# Altium project Sub1G_V2.2_ZM_COM_DOWN_revA1_20160823.PrjPCB
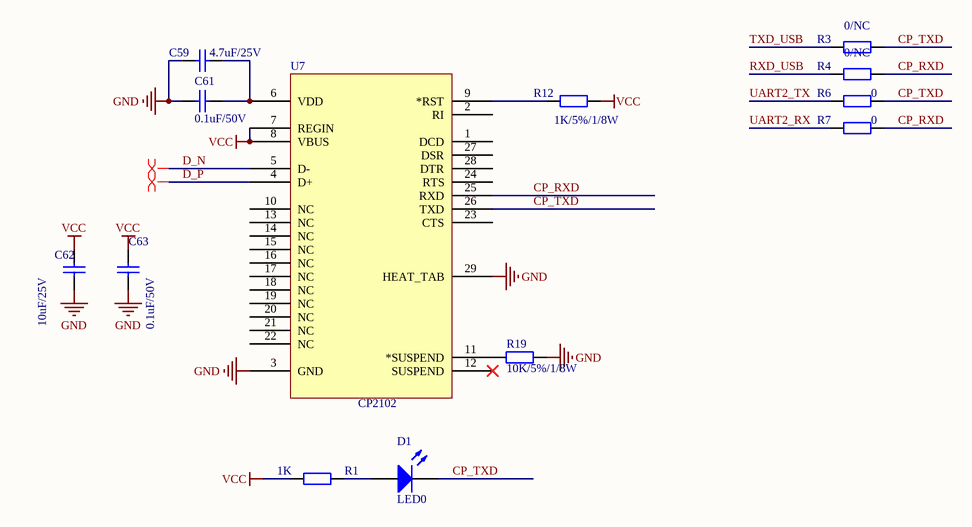
[diagram p0: USB.SchDoc]
3 sheets, 41 parts. Net scope: global (net labels, ports and power ports of the same name join across sheets).
Board files: 拼板.PcbDoc, PCB1.PcbDoc
Sheets:
  USB.SchDoc
  Interface.SchDoc
  RS232.SchDoc

## Sheet USB.SchDoc
size A4

### Parts
C59  4.7uF/25V  [0603C]
C61  0.1uF/50V  [0402C]
C62  10uF/25V  [0603C]
C63  0.1uF/50V  [0402C]
D1  LED0  [0603LED]
R1  1K  [0402R]
R3  0/NC  [0402R]
R4  0/NC  [0402R]
R6  0  [0402R]
R7  0  [0402R]
R12  1K/5%/1/8W  [0402R]
R19  10K/5%/1/8W  [0402R]
U7  CP2102  [QFN28N5X5-0p5P-L]

### Nets
GND: C59.1 C61.2 C62.2 C63.2 R19.1 U7.3(GND) U7.29(HEAT_TAB)
VCC: C62.1 C63.1 R1.1 R12.1 U7.7(REGIN) U7.8(VBUS)
CP_RXD: R4.1 R7.1 U7.25(RXD)
CP_TXD: D1.2(K) R3.1 R6.1 U7.26(TXD)
D_N: U7.5(D-)
D_P: U7.4(D+)
RXD_USB: R4.2
TXD_USB: R3.2
UART2_RX: R7.2
UART2_TX: R6.2
NetC59_2: C59.2 C61.1 U7.6(VDD)
NetD1_1: D1.1(A) R1.2
NetR12_2: R12.2 U7.9(*RST)
NetR19_2: R19.2 U7.11(*SUSPEND)

Not connected (* = marked no-connect by the designer): U7 1(DCD) 2(RI) 10(NC) 12(SUSPEND)* 13(NC) 14(NC) 15(NC) 16(NC) 17(NC) 18(NC) 19(NC) 20(NC) 21(NC) 22(NC) 23(CTS) 24(RTS) 27(DSR) 28(DTR)

### Layout directives
differential pair: D_N, D_P

### Library data of the parts
C59 = Cap: Capacitor; Value: 1uF; Published: 8-Jun-2000; LatestRevisionDate: 17-Jul-2002; LatestRevisionNote: Re-released for DXP Platform.; PackageReference: RAD-0.3; Publisher: Altium Limited
C61 C63 = Cap: Capacitor; Value: 104; Published: 8-Jun-2000; LatestRevisionDate: 17-Jul-2002; LatestRevisionNote: Re-released for DXP Platform.; PackageReference: RAD-0.3; Publisher: Altium Limited
C62 = Cap: Capacitor; Value: 106; Published: 8-Jun-2000; LatestRevisionDate: 17-Jul-2002; LatestRevisionNote: Re-released for DXP Platform.; PackageReference: RAD-0.3; Publisher: Altium Limited
D1 = LED0: Typical INFRARED GaAs LED; Published: 8-Jun-2000; LatestRevisionDate: 08-Jul-2005; LatestRevisionNote: Mech Layer 1 removed.; PackageReference: LED-0; Publisher: Altium Limited
R1 = Resistor: Resistor SMD - IEC symbol version; Value: NC; LatestRevisionDate: 27-Jul-20  -  Semtech
R3 R4 R6 R7 R12 = Res2: Resistor; Value: 1K; Published: 8-Jun-2000; LatestRevisionDate: 17-Jul-2002; LatestRevisionNote: Re-released for DXP Platform.; PackageReference: AXIAL-0.4; Publisher: Altium Limited
R19 = Res2: Resistor; Published: 8-Jun-2000; LatestRevisionDate: 17-Jul-2002; LatestRevisionNote: Re-released for DXP Platform.; PackageReference: AXIAL-0.4; Publisher: Altium Limited; Value: 10K/5%/1/8W
U7 = CP2102: Imported; PART DESC: SINGLE-CHIP USB TO UART BRIDGE, QFN28, RoHS.; MFG #1: SILICON LABS; PART NUMBER: CP2102; Value: Value; RefDes: RefDes; Type: DEV

## Sheet Interface.SchDoc
size A4
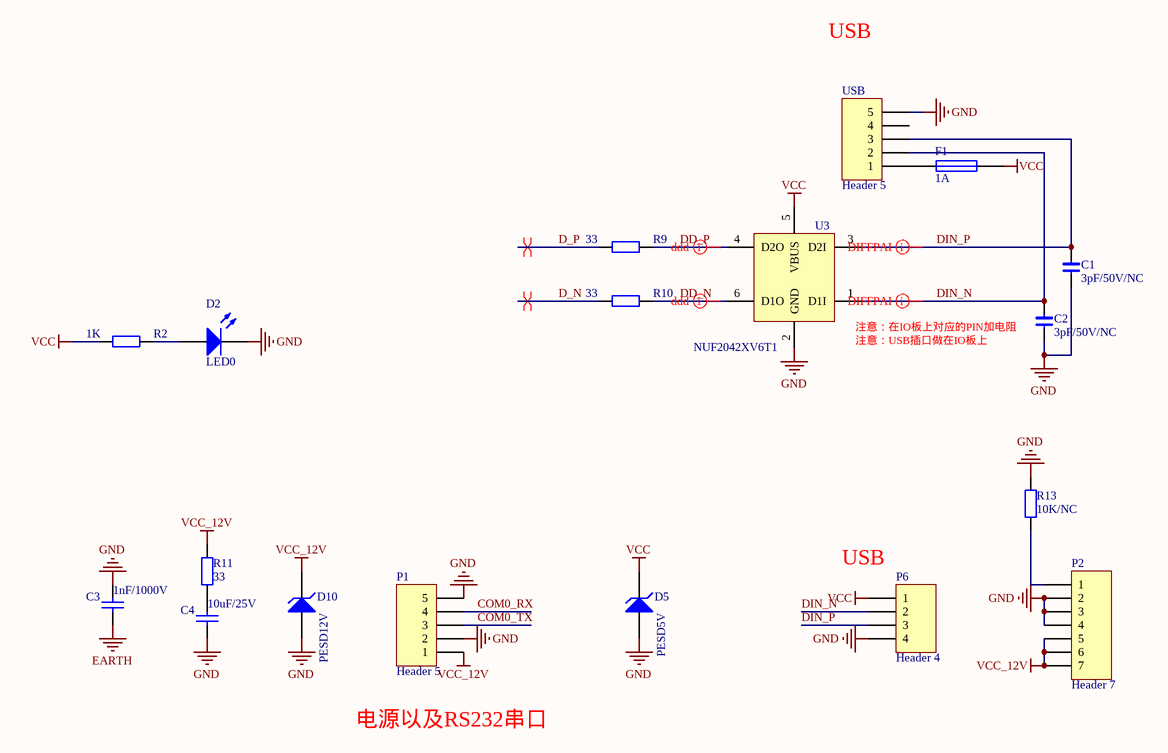
[diagram p1: Interface.SchDoc]

### Parts
C1  3pF/50V/NC  [0402C]
C2  3pF/50V/NC  [0402C]
C3  1nF/1000V  [1206C]
C4  10uF/25V  [0603C]
D2  LED0  [0603LED]
D5  PESD5V  [SOD323]
D10  PESD12V  [SOD323]
F1  1A  [0805R]
P1  Header 5  [KF350-5P]
P2  Header 7  [7×1.25mmSMT]
P6  Header 4  [4×1.25mmSMT]
R2  1K  [0402R]
R9  33  [0402R]
R10  33  [0402R]
R11  33  [0402R]
R13  10K/NC  [0402R]
U3  NUF2042XV6T1  [SOT563-6]
USB  Header 5  [Micro_USB_PH]

### Nets
EARTH: C3.1
GND: C1.2 C2.2 C3.2 C4.1 D2.2(K) D5.A D10.A P1.2 P1.5 P2.2 P2.3 P2.4 P6.4 R13.1 U3.2(GND) USB.5
VCC: D5.K F1.2 P6.1 R2.1 U3.5(VBUS)
VCC_12V: D10.K P1.1 P2.5 P2.6 P2.7 R11.2
COM0_RX: P1.4
COM0_TX: P1.3
D_N: R10.1
D_P: R9.1
DD_N: R10.2 U3.6(D1O)
DD_P: R9.2 U3.4(D2O)
DIN_N: C2.1 P6.2 U3.1(D1I) USB.2
DIN_P: C1.1 P6.3 U3.3(D2I) USB.3
NetC4_2: C4.2 R11.1
NetD2_1: D2.1(A) R2.2
NetF1_1: F1.1 USB.1
NetP2_1: P2.1 R13.2

Not connected (* = marked no-connect by the designer): USB 4

### Layout directives
differential pair: D_N, D_P, DD_N, DD_P, DIN_N, DIN_P

### Notes on the sheet
- USB
- (near U3) 注意：在IO板上对应的PIN加电阻
- (near U3) 注意：USB插口做在IO板上
- (near P6) USB
- 电源以及RS232串口

### Library data of the parts
C1 C2 = C
C3 C4 = Cap: Capacitor; Value: 106/50V; Published: 8-Jun-2000; LatestRevisionDate: 17-Jul-2002; LatestRevisionNote: Re-released for DXP Platform.; PackageReference: RAD-0.3; Publisher: Altium Limited
D2 = LED0: Typical INFRARED GaAs LED; Published: 8-Jun-2000; LatestRevisionDate: 08-Jul-2005; LatestRevisionNote: Mech Layer 1 removed.; PackageReference: LED-0; Publisher: Altium Limited
D5 D10 = D Zener: Zener Diode; Published: 8-Jun-2000; LatestRevisionDate: 17-Jul-2002; LatestRevisionNote: Re-released for DXP Platform.; PackageReference: DIODE-0.7; Publisher: Altium Limited
F1 = Fuse 1: Fuse; Published: 8-Jun-2000; LatestRevisionDate: 17-Jul-2002; LatestRevisionNote: Re-released for DXP Platform.; PackageReference: PIN-W2/E2.8; Publisher: Altium Limited
P1 USB = Header 5: Header, 5-Pin; LatestRevisionDate: 17-Jul-2002; LatestRevisionNote: Re-released for DXP Platform.; Publisher: Altium Limited
P2 = Header 7: Header, 7-Pin; LatestRevisionDate: 17-Jul-2002; LatestRevisionNote: Re-released for DXP Platform.; Publisher: Altium Limited
P6 = Header 4: Header, 4-Pin; LatestRevisionDate: 17-Jul-2002; LatestRevisionNote: Re-released for DXP Platform.; Publisher: Altium Limited
R2 R9-R11 R13 = Resistor: as R1 on sheet USB; LatestRevisionDate: 27-Jul-20  -  Semtech

## Sheet RS232.SchDoc
size A4
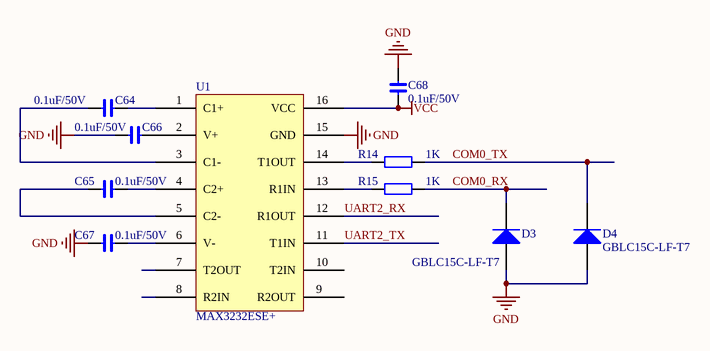
[diagram p2: RS232.SchDoc]

### Parts
C64  0.1uF/50V  [0402C]
C65  0.1uF/50V  [0402C]
C66  0.1uF/50V  [0402C]
C67  0.1uF/50V  [0402C]
C68  0.1uF/50V  [0402C]
D3  GBLC15C-LF-T7  [SOD323]
D4  GBLC15C-LF-T7  [SOD323]
R14  1K  [0402R]
R15  1K  [0402R]
U1  MAX3232ESE+  [SOIC127P600X265-16N]

### Nets
GND: C66.2 C67.2 C68.1 D3.A D4.A U1.15(GND)
VCC: C68.2 U1.16(VCC)
COM0_RX: D3.K R15.1
COM0_TX: D4.K R14.1
UART2_RX: U1.12(R1OUT)
UART2_TX: U1.11(T1IN)
NetC64_1: C64.1 U1.1(C1+)
NetC64_2: C64.2 U1.3(C1-)
NetC65_1: C65.1 U1.4(C2+)
NetC65_2: C65.2 U1.5(C2-)
NetC66_1: C66.1 U1.2(V+)
NetC67_1: C67.1 U1.6(V-)
NetR14_2: R14.2 U1.14(T1OUT)
NetR15_2: R15.2 U1.13(R1IN)

Not connected (* = marked no-connect by the designer): U1 7(T2OUT) 8(R2IN) 9(R2OUT) 10(T2IN)

### Library data of the parts
C64 C65 C67 = C
C66 C68 = C: Value: 0.1uF
D3 D4 = Diode: Default Diode; Published: 8-Jun-2000; LatestRevisionDate: 17-Jul-2002; LatestRevisionNote: Re-released for DXP Platform.; PackageVersion: Sep-1996; PackageReference: SMC; Publisher: Altium Limited; Code_JEDEC: DO-214-AB
R14 R15 = Res2: Resistor; Value: 22R; Published: 8-Jun-2000; LatestRevisionDate: 17-Jul-2002; LatestRevisionNote: Re-released for DXP Platform.; PackageReference: AXIAL-0.4; Publisher: Altium Limited

## Nets that join several sheets
GND: USB (7 pins), Interface (16 pins), RS232 (6 pins)
VCC: USB (6 pins), Interface (5 pins), RS232 (C68.2 U1.16)
COM0_RX: Interface (P1.4), RS232 (D3.K R15.1)
COM0_TX: Interface (P1.3), RS232 (D4.K R14.1)
D_N: USB (U7.5), Interface (R10.1)
D_P: USB (U7.4), Interface (R9.1)
UART2_RX: USB (R7.2), RS232 (U1.12)
UART2_TX: USB (R6.2), RS232 (U1.11)